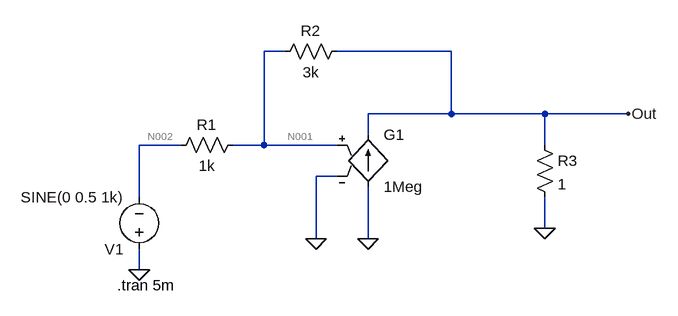
[diagram p0: schematic Q3.asc]
Q3.asc, the LTspice schematic file:
Version 4
SHEET 1 880 680
WIRE 288 0 256 0
WIRE 544 0 368 0
WIRE 544 96 544 0
WIRE 544 96 416 96
WIRE 688 96 544 96
WIRE 816 96 688 96
WIRE 416 128 416 96
WIRE 128 144 64 144
WIRE 256 144 256 0
WIRE 256 144 208 144
WIRE 368 144 256 144
WIRE 688 144 688 96
WIRE 368 192 336 192
WIRE 64 224 64 144
WIRE 688 272 688 224
WIRE 336 288 336 192
WIRE 416 288 416 208
WIRE 64 336 64 304
FLAG 688 272 0
FLAG 336 288 0
FLAG 416 288 0
FLAG 816 96 Out
FLAG 64 336 0
SYMBOL voltage 64 320 R180
WINDOW 123 0 0 Left 0
WINDOW 39 0 0 Left 0
SYMATTR InstName V1
SYMATTR Value SINE(0 0.5 1k)
SYMBOL res 224 128 R90
WINDOW 0 0 56 VBottom 2
WINDOW 3 32 56 VTop 2
SYMATTR InstName R1
SYMATTR Value 1k
SYMBOL res 384 -16 R90
WINDOW 0 0 56 VBottom 2
WINDOW 3 32 56 VTop 2
SYMATTR InstName R2
SYMATTR Value 3k
SYMBOL res 672 128 R0
SYMATTR InstName R3
SYMATTR Value 1
SYMBOL g 416 112 R0
SYMATTR InstName G1
SYMATTR Value 1Meg
TEXT 30 360 Left 2 !.tran 5m

The netlist it stands for:
* Q3.asc
V1 0 N002 SINE(0 0.5 1k)
R1 N001 N002 1k
R2 Out N001 3k
R3 Out 0 1
G1 0 Out N001 0 1Meg
.tran 5m
.backanno
.end

* Results of the author's LTspice run, read from the files saved beside the schematic
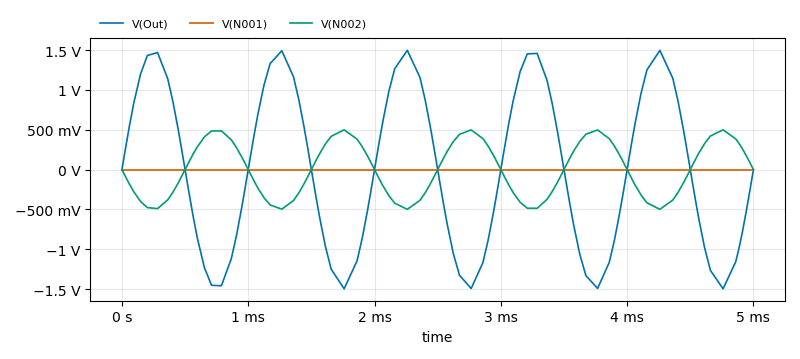
[diagram p1: Transient Analysis of Q3.asc, plotted from the saved traces]
* Transient Analysis, 1 run:
*   V(Out): min -1.496 V, max 1.496 V, average 388.2 µV, rms 1.044 V, last 0 V
*   V(N001): min -1.496 µV, max 1.496 µV, average 388.4 pV, rms 1.044 µV, last 0 V
*   V(N002): min -498.6 mV, max 498.6 mV, average -129.4 µV, rms 348.1 mV, last 0 V